# Altium schematic sheet SHT_4_MCU_07349-R5_L10.SchDoc
size B; CompanyName: Microchip Technology Inc.; Organization: Microchip Technology; Address1: 2355 West Chandler Blvd.; Address2: Chandler, AZ  85224; Address4: USA; SheetNumber: 4; SheetTotal: 9; SheetTitle: Target MCU; Time: Time
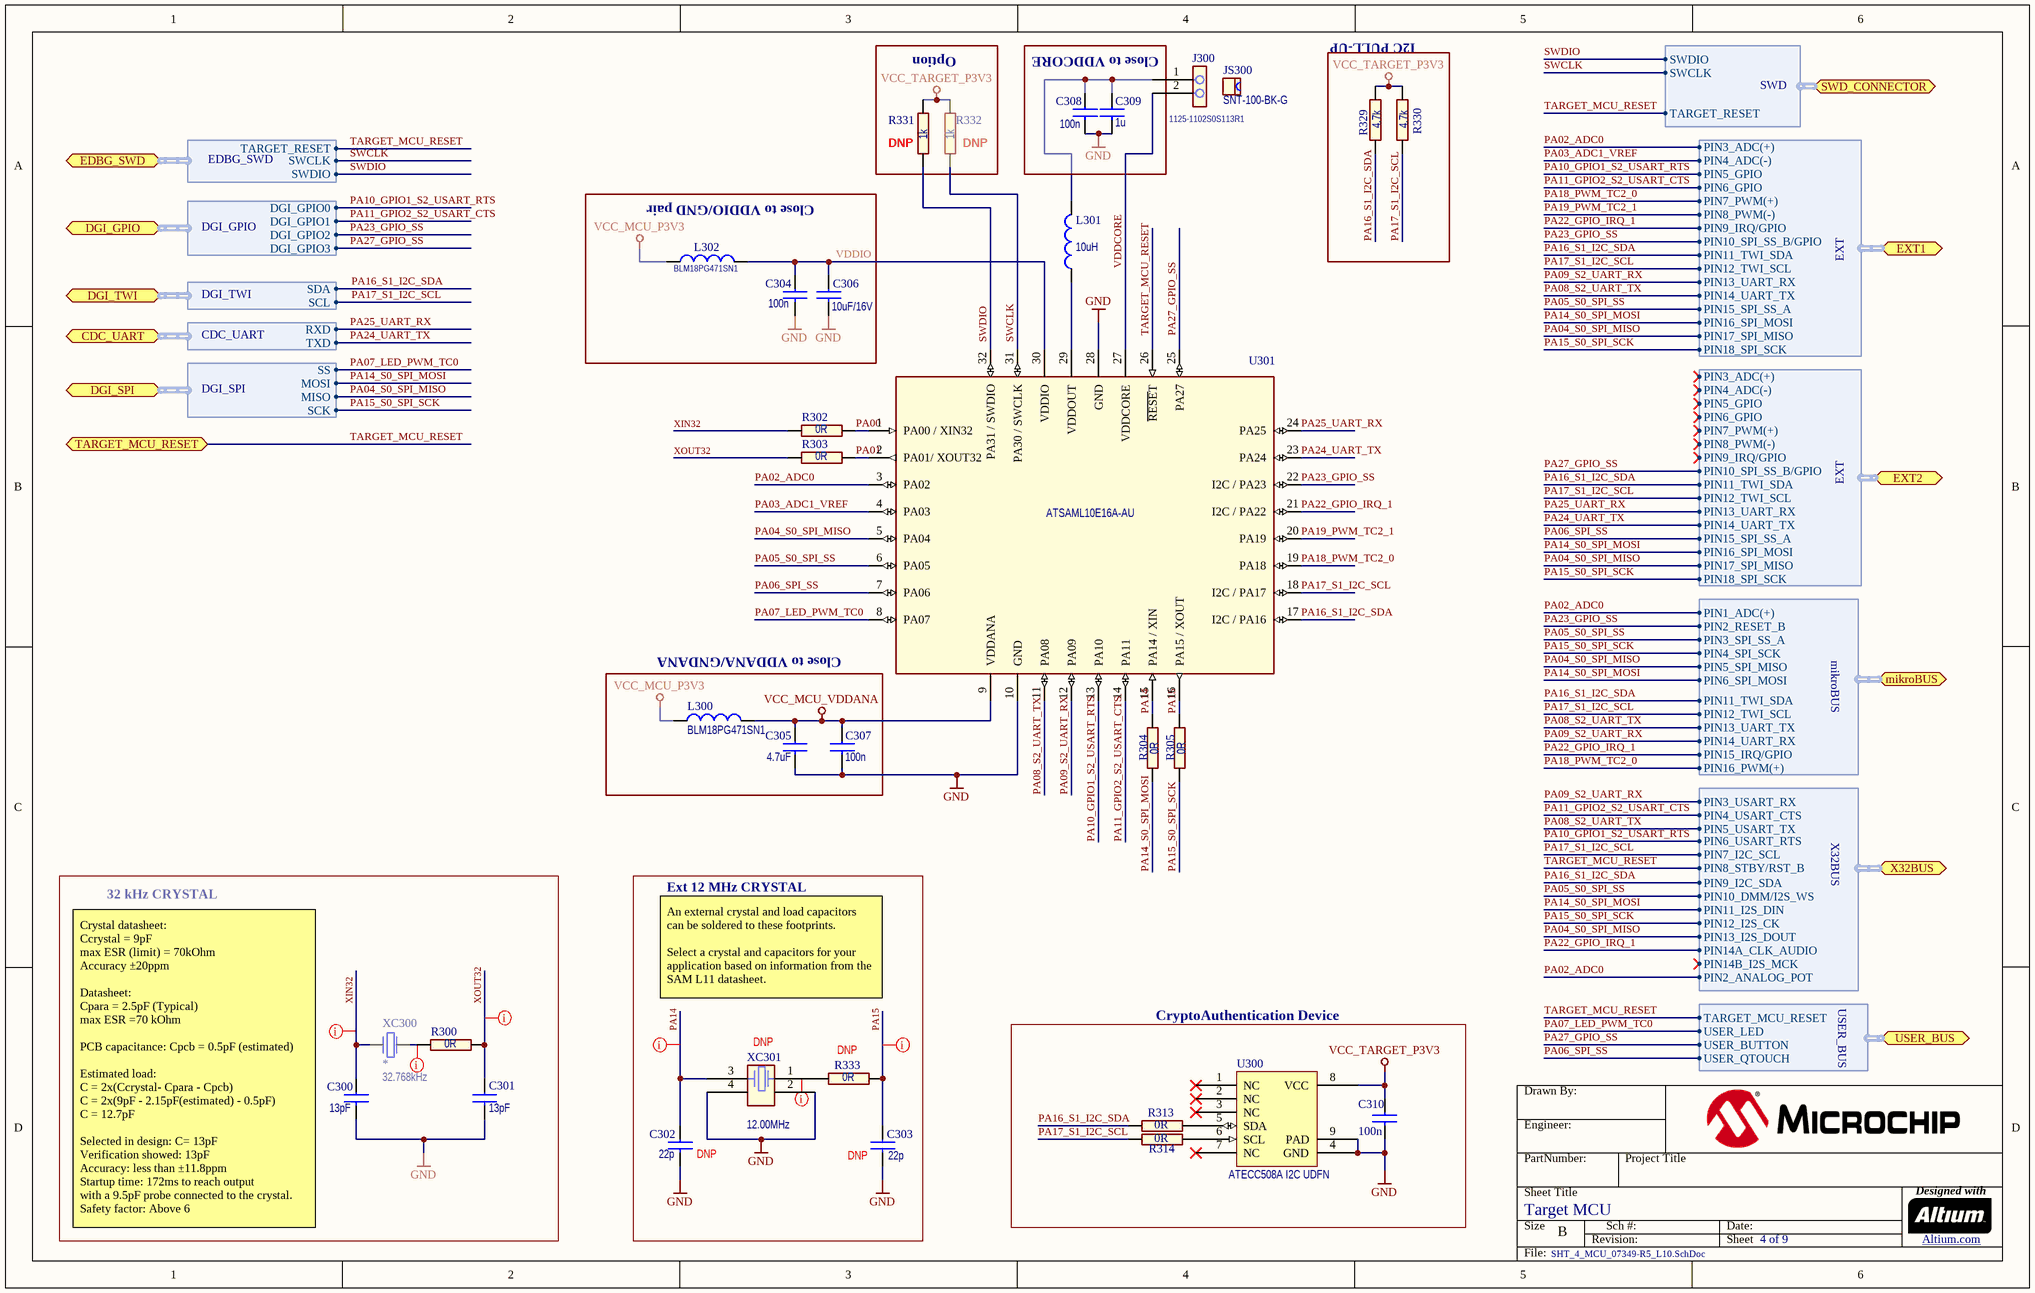
[diagram p0: SHT_4_MCU_07349-R5_L10.SchDoc]

## Parts
?  (no value)  (graphical)
C300  value 13pF  [AP1-00053]  (hidden comment: CAP-NONPOL)
C301  value 13pF  [AP1-00053]  (hidden comment: CAP-NONPOL)
C302  value 22p  Placement: DNP  [AP1-00001]  (hidden comment: CAP-NONPOL)
C303  value 22p  Placement: DNP  [AP1-00001]  (hidden comment: CAP-NONPOL)
C304  value 100n  [AP1-00001]  (hidden comment: CAP-NONPOL)
C305  value 4.7uF  [AP1-00039]  (hidden comment: CAP-NONPOL)
C306  value 10uF/16V  [AP1-00039]  (hidden comment: CAP-NONPOL)
C307  value 100n  [AP1-00001]  (hidden comment: CAP-NONPOL)
C308  value 100n  [AP1-00001]  (hidden comment: CAP-NONPOL)
C309  value 1u  [AP1-00001]  (hidden comment: CAP-NONPOL)
C310  value 100n  [AP1-00053]
J300  MPN: 1125-1102S0S113R1  [AP8-01074]  (hidden comment: HEADER 1x2)
JS300  value SNT-100-BK-G  [AP8-00525]  (hidden comment: To be used by request from ESCATEC)
L300  value BLM18PG471SN1  [AP3-00005]  (hidden comment: INDUCTOR)
L301  value 10uH  [AP3-00157]  (hidden comment: INDUCTOR)
L302  value BLM18PG471SN1  [AP3-00005]  (hidden comment: INDUCTOR)
R300  value 0R  [AP2-00000]
R302  value 0R  [AP2-00000]
R303  value 0R  [AP2-00000]
R304  value 0R  [AP2-00000]
R305  value 0R  [AP2-00000]
R313  value 0R  [AP2-00000]
R314  value 0R  [AP2-00000]
R329  value 4.7k  [AP2-00032]
R330  value 4.7k  [AP2-00032]
R331  value 1k  Placement: DNP  [AP2-00000]
R332  value 1k  Placement: DNP  [AP2-00000]
R333  value 0R  Placement: DNP  [AP2-00000]
U300  value ATECC508A I2C UDFN  [AP6-00409]
U301  ATSAML10E16A-AU  [AP6-00508]
XC300  *  value 32.768kHz  [AP7-00090]
XC301  value 12.00MHz  Placement: DNP  [AP7-00039]

## Blocks framed on the sheet
Option: R331 R332
Close to VDDCORE: C308 C309
I2C PULL-UP: R329 R330
Close to VDDIO/GND pair: C304 C306 L302
32 kHz CRYSTAL: C300 C301 R300 XC300
Ext 12 MHz CRYSTAL: C302 C303 R333 XC301
CryptoAuthentication Device: C310 R313 R314 U300

## Ports
CDC_UART (harness CDC_UART), DGI_GPIO (harness DGI_GPIO), DGI_SPI (harness DGI_SPI), DGI_TWI (harness DGI_TWI), EDBG_SWD (harness EDBG_SWD), EXT1 (harness EXT), EXT2 (harness EXT), mikroBUS (harness mikroBUS), SWD_CONNECTOR (harness SWD), TARGET_MCU_RESET (bidir), USER_BUS (harness USER_BUS), X32BUS (harness X32BUS)

## Harnesses
DGI_GPIO: DGI_GPIO0, DGI_GPIO1, DGI_GPIO2, DGI_GPIO3
DGI_SPI: MISO, MOSI, SCK, SS
DGI_TWI: SCL, SDA
CDC_UART: RXD, TXD
EXT: PIN10_SPI_SS_B/GPIO, PIN11_TWI_SDA, PIN12_TWI_SCL, PIN13_UART_RX, PIN14_UART_TX, PIN15_SPI_SS_A, PIN16_SPI_MOSI, PIN17_SPI_MISO, PIN18_SPI_SCK, PIN3_ADC(+), PIN4_ADC(-), PIN5_GPIO, PIN6_GPIO, PIN7_PWM(+), PIN8_PWM(-), PIN9_IRQ/GPIO
SWD: SWCLK, SWDIO, TARGET_RESET
EDBG_SWD: TARGET_RESET, SWCLK, SWDIO
mikroBUS: PIN1_ADC(+), PIN2_RESET_B, PIN3_SPI_SS_A, PIN4_SPI_SCK, PIN5_SPI_MISO, PIN6_SPI_MOSI, PIN11_TWI_SDA, PIN12_TWI_SCL, PIN13_UART_TX, PIN14_UART_RX, PIN15_IRQ/GPIO, PIN16_PWM(+)
X32BUS: PIN13_I2S_DOUT, PIN11_I2S_DIN, PIN9_I2C_SDA, PIN7_I2C_SCL, PIN5_USART_TX, PIN3_USART_RX, PIN4_USART_CTS, PIN6_USART_RTS, PIN8_STBY/RST_B, PIN10_DMM/I2S_WS, PIN12_I2S_CK, PIN14A_CLK_AUDIO, PIN14B_I2S_MCK, PIN2_ANALOG_POT
USER_BUS: USER_QTOUCH, USER_BUTTON, USER_LED, TARGET_MCU_RESET

## Nets
GND: C300.2 C301.2 C302.2 C303.2 C304.2 C305.2 C306.2 C307.2 C308.2 C309.2 C310.2 U300.4(GND) U300.9(PAD) U301.10(GND) U301.28(GND) XC301.2 XC301.4
VCC_MCU_P3V3: L300.1 L302.2
VCC_MCU_VDDANA: C305.1 C307.1 L300.2 U301.9(VDDANA)
VCC_TARGET_P3V3: C310.1 R329.1 R330.1 R331.1 R332.1 U300.8(VCC)
PA00: R302.2 U301.1(PA00_/_XIN32)
PA01: R303.2 U301.2(PA01/_XOUT32)
PA02_ADC0: U301.3(PA02) ; port EXT1.PIN3_ADC(+), port mikroBUS.PIN1_ADC(+), port X32BUS.PIN2_ANALOG_POT
PA03_ADC1_VREF: U301.4(PA03) ; port EXT1.PIN4_ADC(-)
PA04_S0_SPI_MISO: U301.5(PA04) ; port DGI_SPI.MISO, port EXT1.PIN17_SPI_MISO, port EXT2.PIN17_SPI_MISO, port mikroBUS.PIN5_SPI_MISO, port X32BUS.PIN13_I2S_DOUT
PA05_S0_SPI_SS: U301.6(PA05) ; port EXT1.PIN15_SPI_SS_A, port mikroBUS.PIN3_SPI_SS_A, port X32BUS.PIN10_DMM/I2S_WS
PA06_SPI_SS: U301.7(PA06) ; port EXT2.PIN15_SPI_SS_A, port USER_BUS.USER_QTOUCH
PA07_LED_PWM_TC0: U301.8(PA07) ; port DGI_SPI.SS, port USER_BUS.USER_LED
PA08_S2_UART_TX: U301.11(PA08) ; port EXT1.PIN14_UART_TX, port mikroBUS.PIN13_UART_TX, port X32BUS.PIN5_USART_TX
PA09_S2_UART_RX: U301.12(PA09) ; port EXT1.PIN13_UART_RX, port mikroBUS.PIN14_UART_RX, port X32BUS.PIN3_USART_RX
PA10_GPIO1_S2_USART_RTS: U301.13(PA10) ; port DGI_GPIO.DGI_GPIO0, port EXT1.PIN5_GPIO, port X32BUS.PIN6_USART_RTS
PA11_GPIO2_S2_USART_CTS: U301.14(PA11) ; port DGI_GPIO.DGI_GPIO1, port EXT1.PIN6_GPIO, port X32BUS.PIN4_USART_CTS
PA14: C302.1 R304.2 U301.15(PA14_/_XIN) XC301.3
PA14_S0_SPI_MOSI: R304.1 ; port DGI_SPI.MOSI, port EXT1.PIN16_SPI_MOSI, port EXT2.PIN16_SPI_MOSI, port mikroBUS.PIN6_SPI_MOSI, port X32BUS.PIN11_I2S_DIN
PA15: C303.1 R305.2 R333.1 U301.16(PA15_/_XOUT)
PA15_S0_SPI_SCK: R305.1 ; port DGI_SPI.SCK, port EXT1.PIN18_SPI_SCK, port EXT2.PIN18_SPI_SCK, port mikroBUS.PIN4_SPI_SCK, port X32BUS.PIN12_I2S_CK
PA16_S1_I2C_SDA: R313.2 R329.2 U301.17(I2C_/_PA16) ; port DGI_TWI.SDA, port EXT1.PIN11_TWI_SDA, port EXT2.PIN11_TWI_SDA, port mikroBUS.PIN11_TWI_SDA, port X32BUS.PIN9_I2C_SDA
PA17_S1_I2C_SCL: R314.2 R330.2 U301.18(I2C_/_PA17) ; port DGI_TWI.SCL, port EXT1.PIN12_TWI_SCL, port EXT2.PIN12_TWI_SCL, port mikroBUS.PIN12_TWI_SCL, port X32BUS.PIN7_I2C_SCL
PA18_PWM_TC2_0: U301.19(PA18) ; port EXT1.PIN7_PWM(+), port mikroBUS.PIN16_PWM(+)
PA19_PWM_TC2_1: U301.20(PA19) ; port EXT1.PIN8_PWM(-)
PA22_GPIO_IRQ_1: U301.21(I2C_/_PA22) ; port EXT1.PIN9_IRQ/GPIO, port mikroBUS.PIN15_IRQ/GPIO, port X32BUS.PIN14A_CLK_AUDIO
PA23_GPIO_SS: U301.22(I2C_/_PA23) ; port DGI_GPIO.DGI_GPIO2, port EXT1.PIN10_SPI_SS_B/GPIO, port mikroBUS.PIN2_RESET_B
PA24_UART_TX: U301.23(PA24) ; port CDC_UART.TXD, port EXT2.PIN14_UART_TX
PA25_UART_RX: U301.24(PA25) ; port CDC_UART.RXD, port EXT2.PIN13_UART_RX
PA27_GPIO_SS: U301.25(PA27) ; port DGI_GPIO.DGI_GPIO3, port EXT2.PIN10_SPI_SS_B/GPIO, port USER_BUS.USER_BUTTON
SWCLK: R332.2 U301.31(PA30_/_SWCLK) ; port SWD_CONNECTOR.SWCLK, port EDBG_SWD.SWCLK
SWDIO: R331.2 U301.32(PA31_/_SWDIO) ; port SWD_CONNECTOR.SWDIO, port EDBG_SWD.SWDIO
TARGET_MCU_RESET: U301.26(~{RESE}T) ; port TARGET_MCU_RESET, port SWD_CONNECTOR.TARGET_RESET, port EDBG_SWD.TARGET_RESET, port X32BUS.PIN8_STBY/RST_B, port USER_BUS.TARGET_MCU_RESET
VDDCORE: J300.2 U301.27(VDDCORE)
VDDIO: C304.1 C306.1 L302.1 U301.30(VDDIO)
XIN32: C300.1 R302.1 XC300.2
XOUT32: C301.1 R300.2 R303.1
NetC308_1: C308.1 C309.1 J300.1 L301.1
NetL301_2: L301.2 U301.29(VDDOUT)
NetR300_1: R300.1 XC300.1
NetR313_1: R313.1 U300.5(SDA)
NetR314_1: R314.1 U300.6(SCL)
NetR333_2: R333.2 XC301.1

Not connected (* = marked no-connect by the designer): U300 1(NC)* 2(NC)* 3(NC)* 7(NC)*

## Layout directives
rule Assembly Testpoint Usage [Testpoint - Not Allowed    Multiple - Not Allowed]: (no net found under the mark), NetR300_1, PA14, PA15, XIN32, XOUT32

## Notes on the sheet
- Close to VDDANA/GNDANA
- An external crystal and load capacitors can be soldered to these footprints.
  Select a crystal and capacitors for your application based on information from the SAM L11 datasheet.
- (near C300) Crystal datasheet:
  Ccrystal = 9pF
  max ESR (limit) = 70kOhm
  Accuracy ±20ppm
  Datasheet:
  Cpara = 2.5pF (Typical)
  max ESR =70 kOhm
  PCB capacitance: Cpcb = 0.5pF (estimated)
  Estimated load:
  C = 2x(Ccrystal- Cpara - Cpcb)
  C = 2x(9pF - 2.15pF(estimated) - 0.5pF)
  C = 12.7pF
  Selected in design: C= 13pF
  Verification showed: 13pF
  Accuracy: less than ±11.8ppm
  Startup time: 172ms to reach output
  with a 9.5pF probe connected to the crystal.
  Safety factor: Above 6
- Drawn By:
- Engineer:
- PartNumber:
- Project Title
- Sheet Title
- Size
- B
- Revision:
- Sch #:
- Date:
- Sheet
- Designed with
- Altium.com <http://go.altium.com/MicrochipLandingPage_Evaluation.html>
- File:

## Library data of the parts
? = Title Block B
C300 C301 = A01-0793: Ceramic capacitor, SMD 0402, NP0, 50V, +/-5%; PartGroup: Capacitors,Ceramic,SMD 0402; Manufacturer: Murata; MPN: GRM1555C1H130JA01D; Tolerance: 5%; TemperatureRange: -55 - +125 deg C; ComponentStatus: 'Active (verified)'; Status: Active; Verified by: Lars Helge Mo; Verified date: 2005-12-15; AN: A01-0793; FootprintStatus: 'Active (Verified)'
C302 C303 = A01-0019: Ceramic capacitor, SMD 0402, NP0, 50V, +/-5%; PartGroup: Capacitors,Ceramic,SMD 0402; Manufacturer: YAGEO CORP; MPN: CC0402JRNPO9BN220; TemperatureRange: -55 - +125 deg C; ComponentStatus: 'Active (verified)'; Status: Active; Verified by: Lars Helge Mo; Verified date: 2005-12-15; AN: A01-0019; Tolerance: 50V, +/-5%; Height: 0.550000011920929; FootprintStatus: 'Active (Verified)'
C304 C307 C308 C310 = A01-0246: Ceramic capacitor, SMD 0402, X7R, 16V, +/-10%; PartGroup: Capacitors,Ceramic,SMD 0402; Manufacturer: Kemet; MPN: C0402C104K4RACTU; TemperatureRange: -55 - +125 deg C; ComponentStatus: 'Active (verified)'; Status: Active; Verified by: Lars Helge Mo; Verified date: 2005-12-15; AN: A01-0246; Tolerance: 16V, +/-10%; Height: 0.5; FootprintStatus: 'Active (Verified)'
C305 = A01-0377: Ceramic capacitor, SMD 0603, X5R, 10V, 10% (de31036); PartGroup: Capacitors,Ceramic,SMD 0603; Manufacturer: WALSIN Technology Corporation; MPN: 0603X475K100CT; TemperatureRange: -55 - +85 deg C; ComponentStatus: 'Active (verified)'; Status: Active; Verified by: Lars Helge Mo; Verified date: 2005-12-15; AN: A01-0377; Tolerance: 10%; Height: 0.800000011920929; FootprintStatus: 'Active (Verified)'
C306 = A01-0491: Ceramic capacitor, SMD 0603, X5R, 16V, 10UF ± 20% (High Density); PartGroup: Capacitors,Ceramic,SMD 0603; Manufacturer: Taiyo Yuden; MPN: EMK107BBJ106MA-T; Tolerance: ­± 20%; TemperatureRange: -55°C to +85°C; ComponentStatus: 'Active (verified)'; Status: Active; Verified by: Lars Helge Mo; Verified date: 2005-12-15; AN: A01-0491; Height: 0.819999992847443; FootprintStatus: 'Active (Verified)'
C309 = A01-0286: Ceramic capacitor, SMD 0402, X5R, 6.3V, +/-10% (de26942); PartGroup: Capacitors,Ceramic,SMD 0402; Manufacturer: Kemet; MPN: C0402C105K9PAC; TemperatureRange: -55 to 85 deg C; ComponentStatus: 'Active (verified)'; Status: Active; Verified by: Lars Helge Mo; Verified date: 2005-12-15; AN: A01-0286; Tolerance: +/-10%; Height: 0.5; FootprintStatus: 'Active (Verified)'
J300 = A08-2782: 1x2 pin header, 2.54mm pitch, Pin-in-Paste THM; PartGroup: Mechanical devices,Connectors,Pin headers; Manufacturer: WCON HARDWARE ELECTRONICS CO., LTD; Value: 1125-1102S0S113R1; TemperatureRange: -40Â°C to +105Â°C; ComponentStatus: 'Active (verified)'; Verified date: 2006-01-30; Verified by: Lars Helge; Status: Active; AN: A08-2782; Height: 9; FootprintStatus: 'Active (Verified)'
JS300 = A08-0543: Jumper cap for 2.54mm pinheader; PartGroup: Mechanical devices,Mounting accessories,Other; Manufacturer: SAMTEC; ComponentStatus: 'Active (verified)'; Verified date: 2006-04-05; Verified by: Lars Helge Mo; Status: Active; AN: A08-0543; MPN: SNT-100-BK-G; FootprintStatus: 'Active (Verified)'
L300 L302 = A03-0035: SMD RF inductor 0603. Z=470Ohm (@100MHz), Max R(dc)=0.20Ohm, Max current=1A; PartGroup: Inductors,EMI; Manufacturer: Murata; TemperatureRange: -55; ComponentStatus: 'Active (verified)'; Verified date: 2006-01-30; Verified by: Lars Helge Mo; Status: Active; AN: A03-0035; Height: 0.800000011920929; MPN: BLM18PG471SN1; FootprintStatus: 'Active (Verified)'
L301 = A03-0301: SMD power inductor, LxWxH=3.0x3.0x2.0mm, Isat=2.35A, Ir=1.2A, Rdc=0.28Ohm, 20%; PartGroup: Inductors,Power Inductors; Manufacturer: Wurth Elektronik; MPN: 74438336100; TemperatureRange: -40 to +125 deg C; ComponentStatus: 'Active (verified)'; Verified date: 2006-01-30; Verified by: Lars Helge Mo; Status: Active; AN: A03-0301; Tolerance: 20%; Height: 2; FootprintStatus: 'Active (Verified)'
R300 R302-R305 R313 R314 R333 = A02-0163: RES 0.0 OHM 1/16W 0402 SMD; PartGroup: Resistors,SMD,0402 1%; Manufacturer: (n/a); MPN: RMCF0402ZT0R00; Tolerance: 1 %; TemperatureRange: -55 - +125 deg C; ComponentStatus: 'Active (verified)'; Status: Active; Verified by: Lars Helge Mo; Verified date: 2005-12-19; AN: A02-0163; Height: 0.349999994039536; FootprintStatus: 'Active (Verified)'
R329 R330 = A02-0765: Thick film resistor, SMD 0402, 1/16W, 5%; PartGroup: Resistors,SMD,0402 5%; Manufacturer: (n/a); MPN: CR10-4701-FK; TemperatureRange: -55°C to +125°C; ComponentStatus: 'Active (verified)'; Status: Active; Verified by: Lars Helge Mo; Verified date: 2005-12-19; AN: A02-0765; Tolerance: 5%; Height: 0.349999994039536; FootprintStatus: 'Active (Verified)'
R331 R332 = A02-0212: Thick film resistor, SMD 0402, 1/16W, 1%; PartGroup: Resistors,SMD,0402 1%; Manufacturer: ASJ; MPN: CR10-1001-FK; TemperatureRange: -55 - +125 deg C; ComponentStatus: 'Active (verified)'; Status: Active; Verified by: Lars Helge Mo; Verified date: 2005-12-19; AN: A02-0212; Tolerance: 1 %; Height: 0.349999994039536; FootprintStatus: 'Active (Verified)'
U300 = A06-1281: ATECC508A with an I2C Interface and a 8 Pin UDFN Package with Paddle; PartGroup: Integrated Circuits,Special function,Encryption; Manufacturer: MICROCHIP; MPN: ATECC508A-MAHDA-T; ComponentStatus: 'Active (verified)'; Status: New; AN: A06-1281; Height: 0.600000023841858; FootprintStatus: 'Active (Verified)'
U301 = A06-1590: 32 Bit Ultra Low Power MCU w/ 64K Flash; PartGroup: Integrated Circuits,MCU, MPU, DSP,ARM MCU; Manufacturer: Microchip; ComponentStatus: 'Active (verified)'; Status: New; Verified by: *; Verified date: *; Design comments: *; AN: A06-1590; Value: ATSAML10E16A-AU; Height: 1; MPN: ATSAML10E16A-AU; FootprintStatus: 'Active (Verified)'
XC300 = A07-0129: Kyocera ST3215SB32768E0HPWBB, 32.768kHz, 9pF, SMD tuning fork crystal; PartGroup: Frequency devices,Crystals,SMD; Manufacturer: Kyocera Crystal Device Corporation; Tolerance: Â±20ppm; TemperatureRange: -40Â°C to +85Â°C; ComponentStatus: 'Active (verified)'; AN: A07-0129; Height: 0.800000011920929; MPN: ST3215SB32768E0HPWBB; FootprintStatus: 'Active (Verified)'; Status: Active; Verified by: Sveinung Helgeland; Verified date: 2006-02-17
XC301 = A07-0042: Fox FQ5032B 12.0000MHz  20pF SMD crystal 738B-12; PartGroup: Frequency devices,Crystals,SMD; Manufacturer: Fox  Electronics; MPN: FQ5032B-12.000; Tolerance: Â±30ppm; TemperatureRange: 0Â°C ~ 70Â°C; ComponentStatus: 'Active (verified)'; Status: Active; Verified by: Ketil Skjerve; Verified date: 2007-06-15; AN: A07-0042; Height: 1.20000004768372; FootprintStatus: 'Active (Verified)'